# EAGLE design daughter (EAGLE 6.5.0)
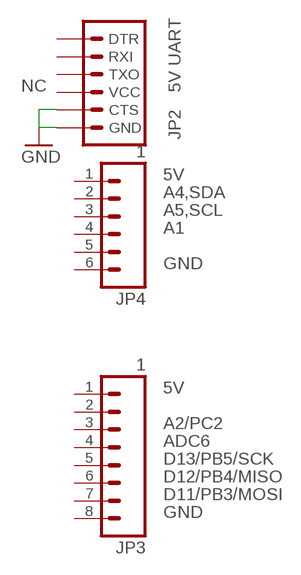
[diagram p0: schematic, sheet 1]

## Parts
JP2  5V UART  ARDUINO_SERIAL_PROGRAMPTH  [1X06]
JP3  1  M081X08  [1X08]
JP4  1  M06SIP  [1X06]

## Nets
GND: JP2.5(CTS) JP2.6(GND)
Unconnected: JP2.1(DTR) JP2.2(RXI) JP2.3(TXO) JP2.4(VCC) JP3.1 JP3.2 JP3.3 JP3.4 JP3.5 JP3.6 JP3.7 JP3.8 JP4.1 JP4.2 JP4.3 JP4.4 JP4.5 JP4.6

## Notes on the sheet
- NC
- 5V
- A4,SDA
- A5,SCL
- A1
- GND
- 5V
- A2/PC2
- ADC6
- D13/PB5/SCK
- D12/PB4/MISO
- D11/PB3/MOSI
- GND

## Library data of the parts
JP2 = SparkFun:ARDUINO_SERIAL_PROGRAM
JP3 = SparkFun-Connectors:M08: Header 8 Standard 8-pin 0.1" header. Use with straight break away headers (SKU : PRT-00116), right angle break away headers (PRT-00553), swiss pins (PRT-00743), machine pins (PRT-00117), and female headers (PRT-00115).
JP4 = SparkFun-Connectors:M06: Header 6 Standard 6-pin 0.1" header. Use with straight break away headers (SKU : PRT-00116), right angle break away headers (PRT-00553), swiss pins (PRT-00743), machine pins (PRT-00117), and female headers (PRT-00115). Molex polarized connector foot print use with SKU : PRT-08094 with associated crimp pins and housings. NOTES ON THE VARIANTS LOCK and LOCK_LONGPADS... This footprint was designed to help hold the alignment of a through-hole component (i.e. 6-pin header) while soldering it into place. You may notice that each hole has been shifted either up or down by 0.005 of an inch from it's more standard position (which is a perfectly straight line). This slight alteration caused the pins (the squares in the middle) to touch the edges of the holes. Because they are alternating, it causes a "brace" to hold the component in place. 0.005 has proven to be the perfect amount of "off-center" position when using our standard breakaway headers. Although looks a little odd when you look at the bare footprint, once you have a header in there, the alteration is very hard to notice. Also, if you push a header all the way into place, it is covered up entirely on the bottom side. This idea of altering the position of holes to aid alignment will be further integrated into the Sparkfun Library for other footprints. It can help hold any component with 3 or more connection pins.

## Net classes
1 vcc: width 0.254 mm

## Board
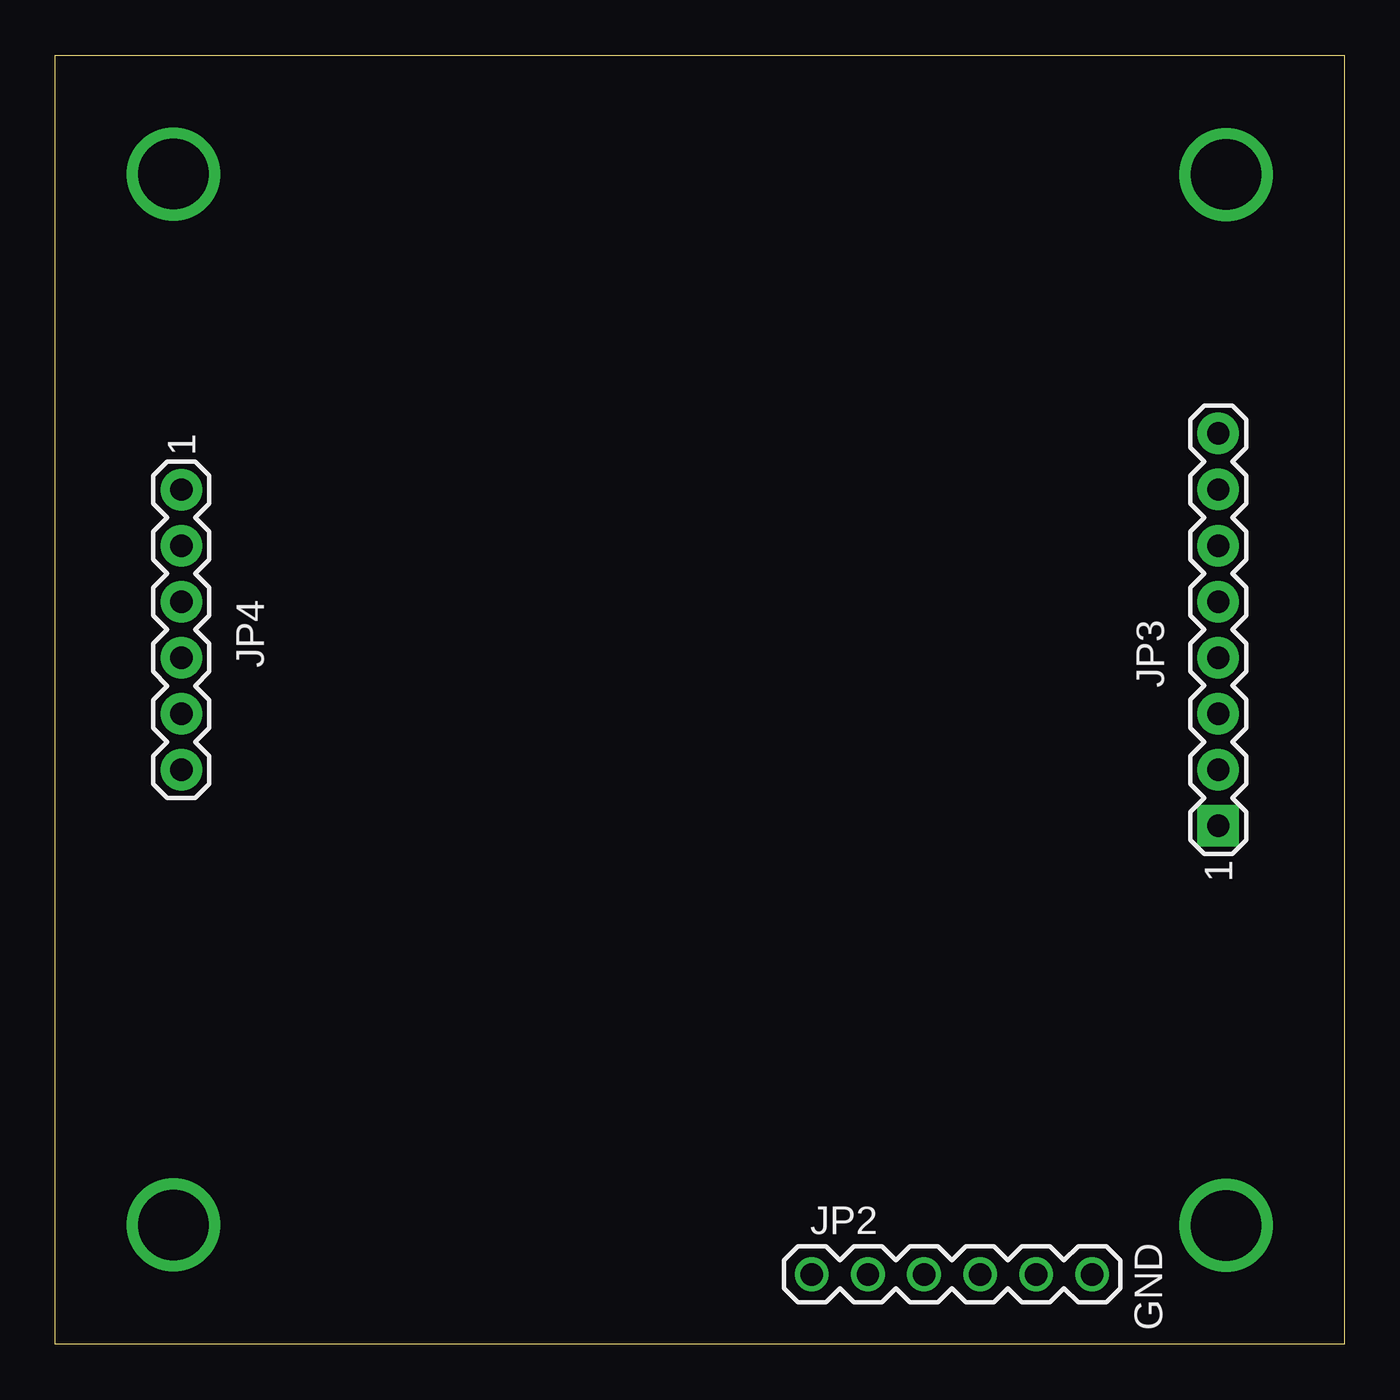
[diagram p1: board, top side]
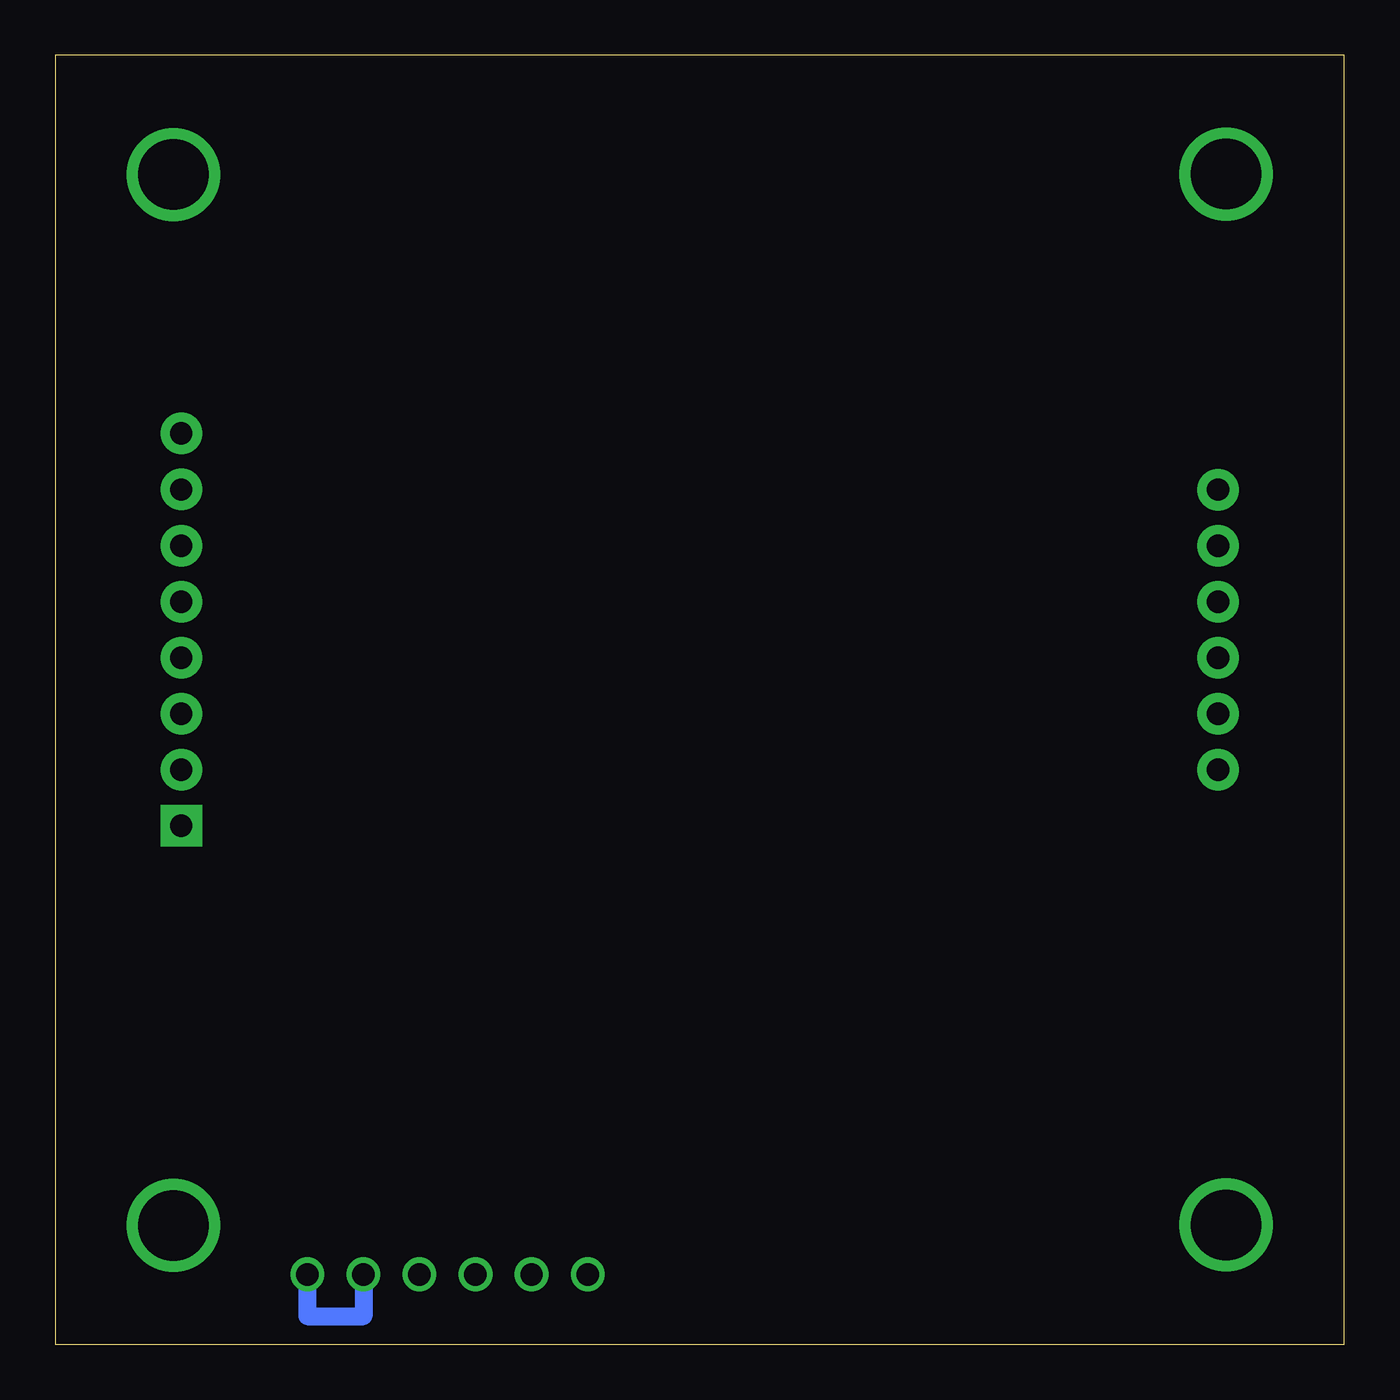
[diagram p2: board, bottom side, seen from below]

Size 58.42 x 58.42 mm. Coordinates in mm from the lower left corner, seen from the top.
Outline: 0,58.42 58.42,58.42 58.42,0 0,0 0,58.42
Copper layers (1*16): Top 0.0356mm / dielectric 1.5011mm / Bottom 0.0356mm
Design rules "OSH": minimum track width 6mil, minimum drill 13mil, track to track 6mil, track to pad 6mil, pad to pad 6mil, via to via 6mil, smd to smd 6mil, copper to edge 15mil, drill to drill 6mil, minimum pad ring 7mil, minimum via ring 7mil, stop-mask expansion 3mil, vias tented up to drill 0mil, thermal gap 10mil

### Footprints (pad centres in the part's own frame; a part is rotated, then mirrored left to right if it is on the bottom)
1X06 = drill 1.016: 1 0,0; 2 2.54,0; 3 5.08,0; 4 7.62,0; 5 10.16,0; 6 12.7,0
1X08 = drill 1.016 pad 1.88 square: 1 0,0 | drill 1.016 pad 1.88: 2 2.54,0; 3 5.08,0; 4 7.62,0; 5 10.16,0; 6 12.7,0; 7 15.24,0; 8 17.78,0
1X06' = drill 1.016 pad 1.88: 1 0,0; 2 2.54,0; 3 5.08,0; 4 7.62,0; 5 10.16,0; 6 12.7,0

### Placement (x,y rotation side)
JP2  34.29,3.17 0 top
JP3  52.71,23.5 90 top
JP4  1  [1X06']  5.72,38.73 270 top

### Tracks (layer width: path | path; a pad name or v marks a point on that pad's centre or on a via)
GND
  Bottom 0.813: JP2.6 46.99,1.27 44.45,1.27 JP2.5
N$3  (via drill 3.2)
  other vias: 53.06,53.01
N$4  (via drill 3.2)
  other vias: 5.36,53.04 5.36,5.41
N$7  (via drill 3.2)
  other vias: 53.06,5.38

### Text on the board
tPlace: GND